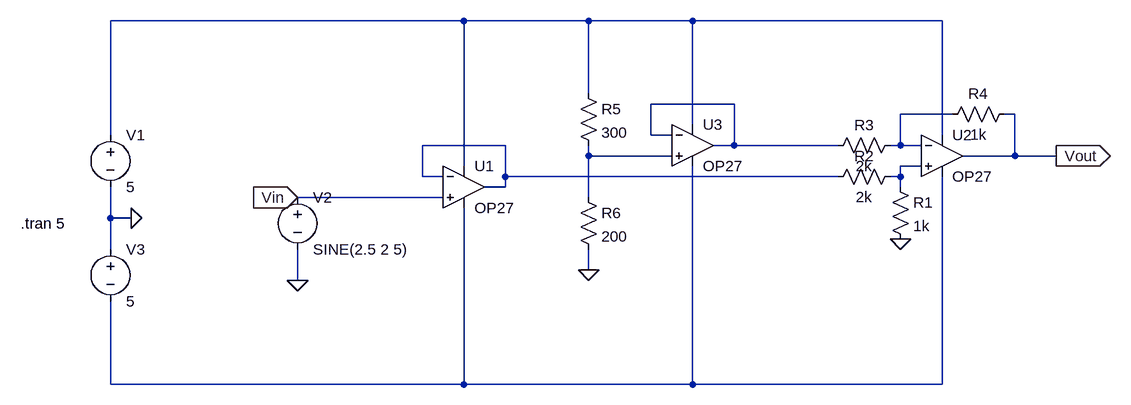
[diagram p0: schematic Output.asc]
Output.asc, the LTspice schematic file:
Version 4
SHEET 1 1248 680
WIRE 224 -96 -320 -96
WIRE 416 -96 224 -96
WIRE 576 -96 416 -96
WIRE 960 -96 576 -96
WIRE 416 16 416 -96
WIRE 640 32 512 32
WIRE 976 48 896 48
WIRE 1072 48 1056 48
WIRE 576 64 576 -96
WIRE -320 80 -320 -96
WIRE 512 80 512 32
WIRE 544 80 512 80
WIRE 960 80 960 -96
WIRE 288 96 160 96
WIRE 640 96 640 32
WIRE 640 96 608 96
WIRE 800 96 640 96
WIRE 896 96 896 48
WIRE 896 96 880 96
WIRE 928 96 896 96
WIRE 416 112 416 96
WIRE 544 112 416 112
WIRE 1072 112 1072 48
WIRE 1072 112 992 112
WIRE 1136 112 1072 112
WIRE 224 128 224 -96
WIRE 928 128 896 128
WIRE 160 144 160 96
WIRE 192 144 160 144
WIRE 288 144 288 96
WIRE 800 144 288 144
WIRE 896 144 896 128
WIRE 896 144 880 144
WIRE 288 160 288 144
WIRE 288 160 256 160
WIRE 896 160 896 144
WIRE 192 176 -32 176
WIRE 416 176 416 112
WIRE -320 208 -320 160
WIRE -288 208 -320 208
WIRE -320 256 -320 208
WIRE 416 288 416 256
WIRE -32 304 -32 256
WIRE -320 464 -320 336
WIRE 224 464 224 192
WIRE 224 464 -320 464
WIRE 576 464 576 128
WIRE 576 464 224 464
WIRE 960 464 960 144
WIRE 960 464 576 464
FLAG -32 304 0
FLAG -32 176 Vin
IOPIN -32 176 In
FLAG 896 240 0
FLAG 1136 112 Vout
IOPIN 1136 112 Out
FLAG -288 208 0
FLAG 416 288 0
SYMBOL OpAmps\\OP27 224 96 R0
SYMATTR InstName U1
SYMBOL OpAmps\\OP27 960 48 R0
SYMATTR InstName U2
SYMBOL voltage -320 64 R0
WINDOW 123 0 0 Left 0
WINDOW 39 0 0 Left 0
SYMATTR InstName V1
SYMATTR Value 5
SYMBOL voltage -32 160 R0
WINDOW 123 0 0 Left 0
WINDOW 39 0 0 Left 0
SYMATTR InstName V2
SYMATTR Value SINE(2.5 2 5)
SYMBOL res 880 144 R0
SYMATTR InstName R1
SYMATTR Value 1k
SYMBOL res 896 128 R90
WINDOW 0 0 56 VBottom 2
WINDOW 3 32 56 VTop 2
SYMATTR InstName R2
SYMATTR Value 2k
SYMBOL res 896 80 R90
WINDOW 0 0 56 VBottom 2
WINDOW 3 32 56 VTop 2
SYMATTR InstName R3
SYMATTR Value 2k
SYMBOL res 1072 32 R90
WINDOW 0 0 56 VBottom 2
WINDOW 3 32 56 VTop 2
SYMATTR InstName R4
SYMATTR Value 1k
SYMBOL res 400 0 R0
SYMATTR InstName R5
SYMATTR Value 300
SYMBOL res 400 160 R0
SYMATTR InstName R6
SYMATTR Value 200
SYMBOL voltage -320 240 R0
WINDOW 123 0 0 Left 0
WINDOW 39 0 0 Left 0
SYMATTR InstName V3
SYMATTR Value 5
SYMBOL OpAmps\\OP27 576 32 R0
SYMATTR InstName U3
TEXT -458 216 Left 2 !.tran 5

The netlist it stands for:
* Output.asc
XU1 Vin N004 N001 N007 N004 OP27  ; pins In+ In- V+ V- OUT
XU2 N006 N003 N001 N007 Vout OP27  ; pins In+ In- V+ V- OUT
V1 N001 0 5
V2 Vin 0 SINE(2.5 2 5)
R1 N006 0 1k
R2 N006 N004 2k
R3 N003 N002 2k
R4 Vout N003 1k
R5 N001 N005 300
R6 N005 0 200
V3 0 N007 5
XU3 N005 N002 N001 N007 N002 OP27  ; pins In+ In- V+ V- OUT
.tran 5
.lib ADI.lib
.backanno
.end